# EAGLE design PFC_Method_Lighting_V1.1 (EAGLE 9.2.2)
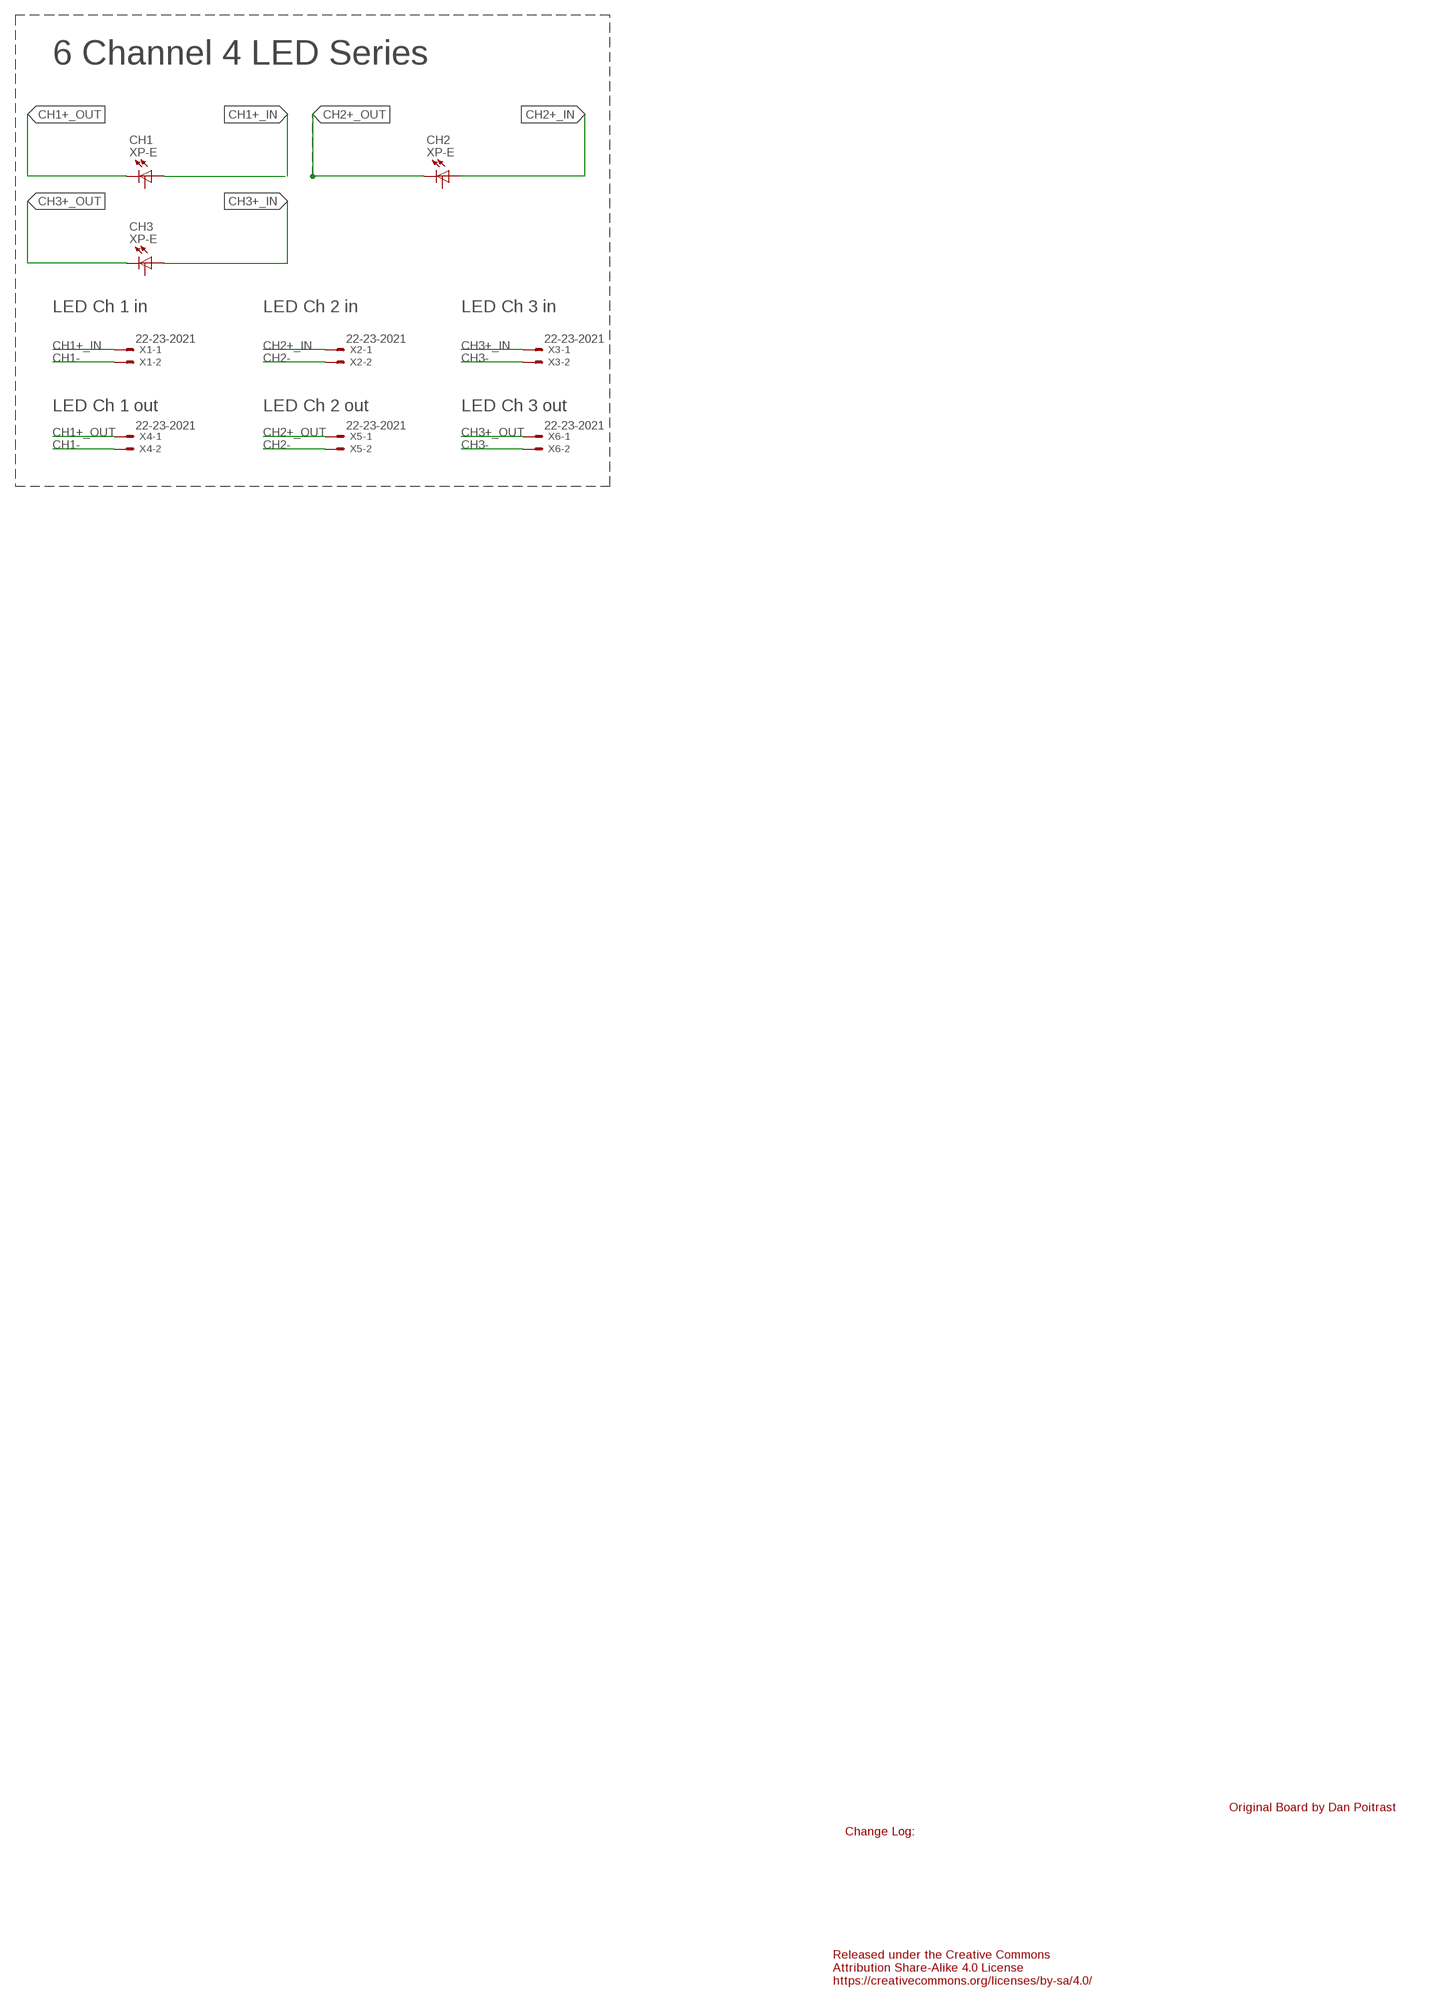
[diagram p0: schematic, sheet 1]

## Parts
CH1  XP-E  LED_W/THERM-XP-E  [CREE-XLAMP-XP-E]
CH2  XP-E  LED_W/THERM-XP-E  [CREE-XLAMP-XP-E]
CH3  XP-E  LED_W/THERM-XP-E  [CREE-XLAMP-XP-E]
X1  22-23-2021  [22-23-2021]
X2  22-23-2021  [22-23-2021]
X3  22-23-2021  [22-23-2021]
X4  22-23-2021  [22-23-2021]
X5  22-23-2021  [22-23-2021]
X6  22-23-2021  [22-23-2021]

## Nets
CH1+_IN: CH1.A CH1.A@1(A) X1.1
CH1+_OUT: CH1.C CH1.C@1(C) X4.1
CH1-: X1.2 X4.2
CH2+_IN: CH2.A CH2.A@1(A) X2.1
CH2+_OUT: CH2.C CH2.C@1(C) X5.1
CH2-: X2.2 X5.2
CH3+_IN: CH3.A CH3.A@1(A) X3.1
CH3+_OUT: CH3.C CH3.C@1(C) X6.1
CH3-: X3.2 X6.2
Unconnected: CH1.THERM CH2.THERM CH3.THERM

## Notes on the sheet
- 6 Channel 4 LED Series
- LED Ch 1 in | LED Ch 2 in | LED Ch 3 in
- LED Ch 1 out | LED Ch 2 out | LED Ch 3 out
- Original Board by Dan Poitrast
- Change Log:
- Released under the Creative Commons
  Attribution Share-Alike 4.0 License
  https://creativecommons.org/licenses/by-sa/4.0/

## Library data of the parts
CH1-CH3 = Tomaszewski:LED_W/THERM
X1-X6 = con-molex:22-23-2021: .100" (2.54mm) Center Header - 2 Pin; MF: MOLEX; MPN: 22-23-2021; OC_FARNELL: 1462926; OC_NEWARK: 25C3832

## Net classes
0 default: width 0.305 mm, drill 0.254 mm, clearance 0.254 mm

## Board
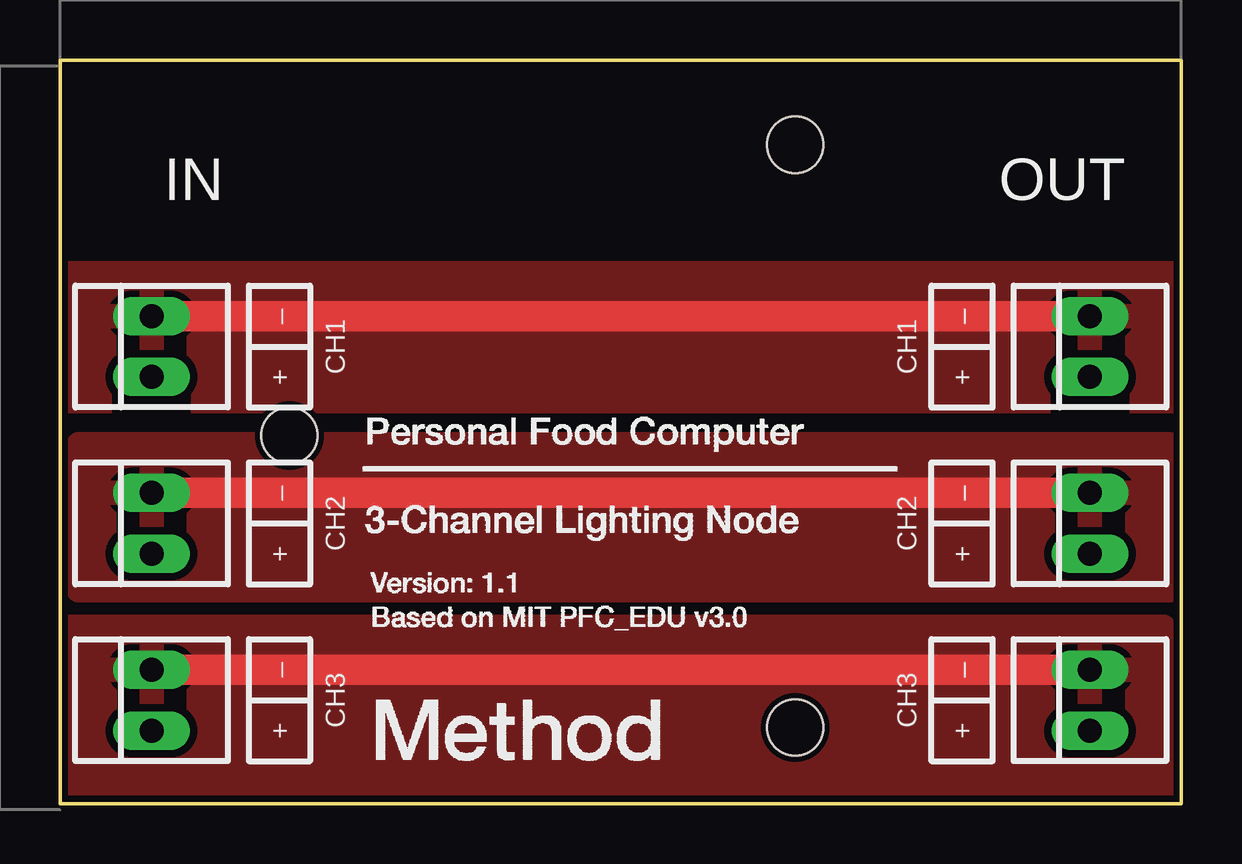
[diagram p1: board, top side]
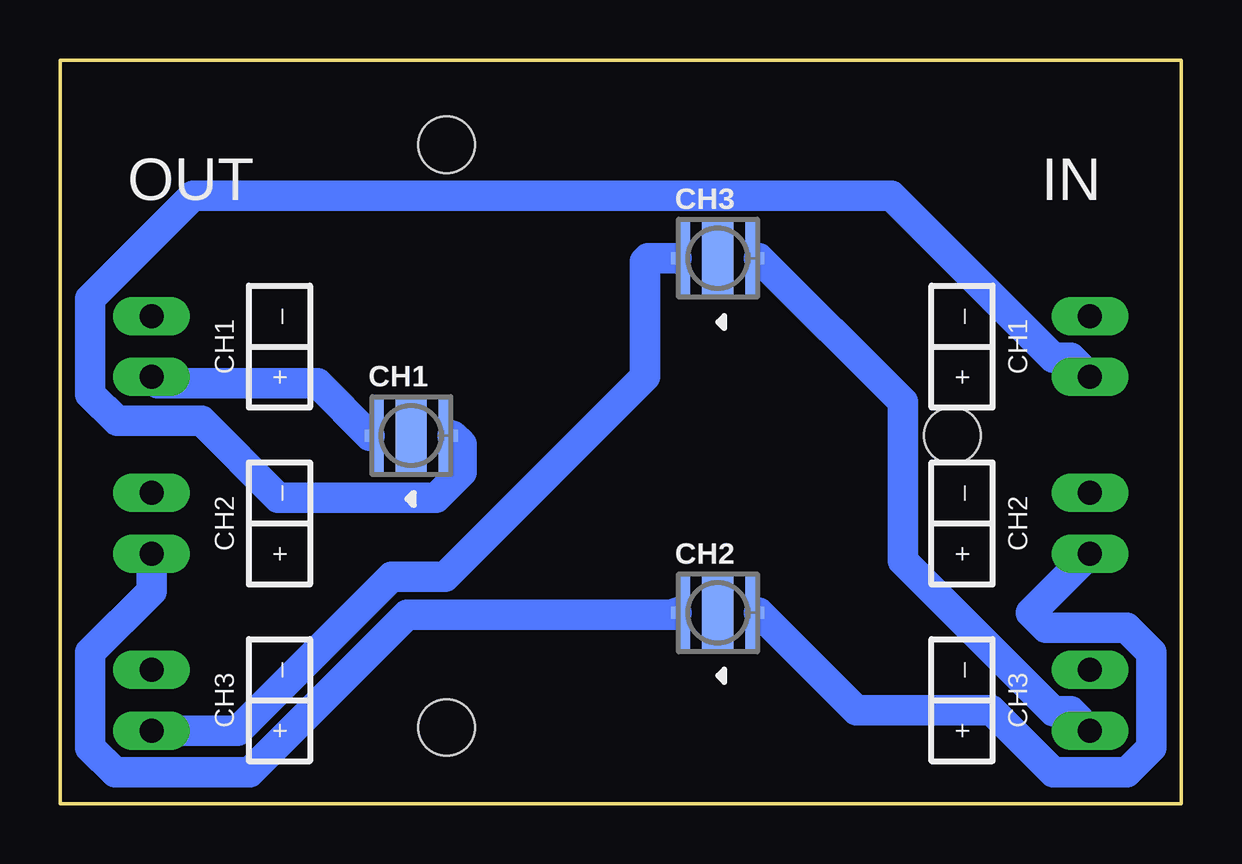
[diagram p2: board, bottom side, seen from below]

Size 46.74 x 30.99 mm. Coordinates in mm from the lower left corner, seen from the top.
Outline: 0,0 0,30.99 46.74,30.99 46.74,0 0,0
Copper layers (1*16): Top 0.035mm / dielectric 1.5mm / Bottom 0.035mm
Design rules "SparkFun *": minimum track width 8mil, minimum drill 20mil, track to track 12mil, track to pad 12mil, pad to pad 12mil, via to via 12mil, smd to smd 8mil, copper to edge 10mil, drill to drill 8mil, minimum pad ring 12mil, minimum via ring 10mil, stop-mask expansion 4mil, vias tented up to drill 25mil, thermal gap 10mil
Holes 2.35 mm at 30.63,27.46 9.55,15.34 30.63,3.17

### Footprints (pad centres in the part's own frame; a part is rotated, then mirrored left to right if it is on the bottom)
CREE-XLAMP-XP-E = smd 0.5 x 3.3: A 1.4,0; C -1.4,0 | smd 0.45 x 0.5: A@1 1.725,0; C@1 -1.725,0 | smd 1.3 x 3.3: THERM 0,0
22-23-2021 = drill 1 long: 1 -1.27,0; 2 1.27,0

### Placement (x,y rotation side)
CH1  32.11,15.34 0 bottom
CH2  19.33,7.95 0 bottom
CH3  19.33,22.73 0 bottom
X1  3.81,19.05 90 top
X2  3.81,11.68 90 top
X3  3.81,4.32 90 top
X4  42.93,19.05 90 top
X5  42.93,11.68 90 top
X6  42.93,4.32 90 top

### Tracks (layer width: path | path; a pad name or v marks a point on that pad's centre or on a via)
CH1+_IN
  Bottom 1.27: CH1.A@1 30.01,14.97 30.01,13.81 31.07,12.75 37.64,12.75 40.84,15.95 44.37,15.95 45.47,17.06 45.47,21.04 41.2,25.32 12.09,25.32 5.34,18.58 4.61,18.58 X1.1
CH1+_OUT
  Bottom 1.27: CH1.C@1 36.02,17.53 42.67,17.53 X4.1
CH1-
  Top 1.27: X1.2 X4.2
  pour Top: 0,22.1 0,16.76 46.74,16.76 46.74,22.1
CH2+_IN
  Bottom 0.61: 5.2,1.63 2.42,1.63 1.59,2.46 1.59,6.17 2.42,7 5.33,7 6.27,7.95
  Bottom 1.27: X2.1 6.27,7.95 5.66,7.33 2.28,7.33 1.26,6.31 1.26,2.33 2.28,1.3 5.34,1.3 7.92,3.89 13.54,3.89 CH2.A@1
CH2+_OUT
  Bottom 1.27: CH2.C@1 21.13,7.87 32.28,7.87 38.85,1.3 44.45,1.3 45.47,2.33 45.47,6.31 42.93,8.86 X5.1
CH2-
  Top 1.27: X2.2 X5.2
  pour Top: 0.76,14.99 0.76,8.89 46.23,8.89 46.23,14.99
CH3+_IN
  Bottom 1.27: CH3.A@1 11.61,16.74 11.61,10.12 5.34,3.84 4.61,3.84 X3.1
CH3+_OUT
  Bottom 1.27: X6.1 39.33,3.05 32.93,9.45 30.68,9.45 22.35,17.78 22.35,22.61 22.23,22.73 CH3.C@1
CH3-
  Top 1.27: X3.2 X6.2
  pour Top: 0.25,0.51 45.97,0.51 45.97,7.37 -0.01,7.37 0.25,0.76

### Text on the board
tPlace: IN | OUT | – | – | CH1 | CH1 | + | + | – | – | CH2 | CH2 | + | + | – | – | CH3 | CH3 | + | +
bPlace: IN | OUT | – | – | CH1 | CH1 | + | + | – | – | CH2 | CH2 | + | + | – | – | CH3 | CH3 | + | +